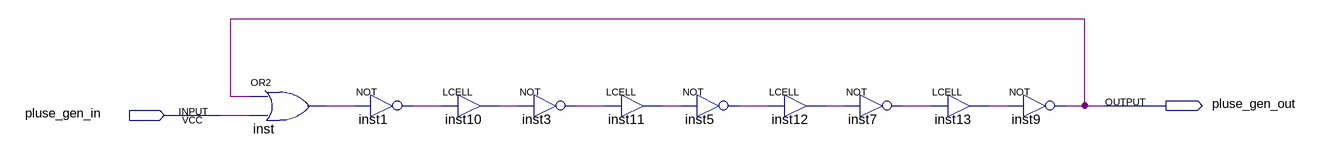
[diagram p0: schematic sheet]
// Quartus schematic pluse_gen.bdf as structural Verilog: 10 symbols, 2 pins
module pluse_gen (
  input  pluse_gen_in,
  output pluse_gen_out
);

  wire inst1_out, inst3_out, inst5_out, inst7_out, inst10_out, inst11_out, inst12_out, inst13_out, inst_out;

  or inst (inst_out, pluse_gen_out, pluse_gen_in);
  not inst1 (inst1_out, inst_out);
  LCELL inst10 (.IN(inst1_out), .OUT(inst10_out));
  not inst3 (inst3_out, inst10_out);
  LCELL inst11 (.IN(inst3_out), .OUT(inst11_out));
  not inst5 (inst5_out, inst11_out);
  LCELL inst12 (.IN(inst5_out), .OUT(inst12_out));
  not inst7 (inst7_out, inst12_out);
  LCELL inst13 (.IN(inst7_out), .OUT(inst13_out));
  not inst9 (pluse_gen_out, inst13_out);
endmodule
